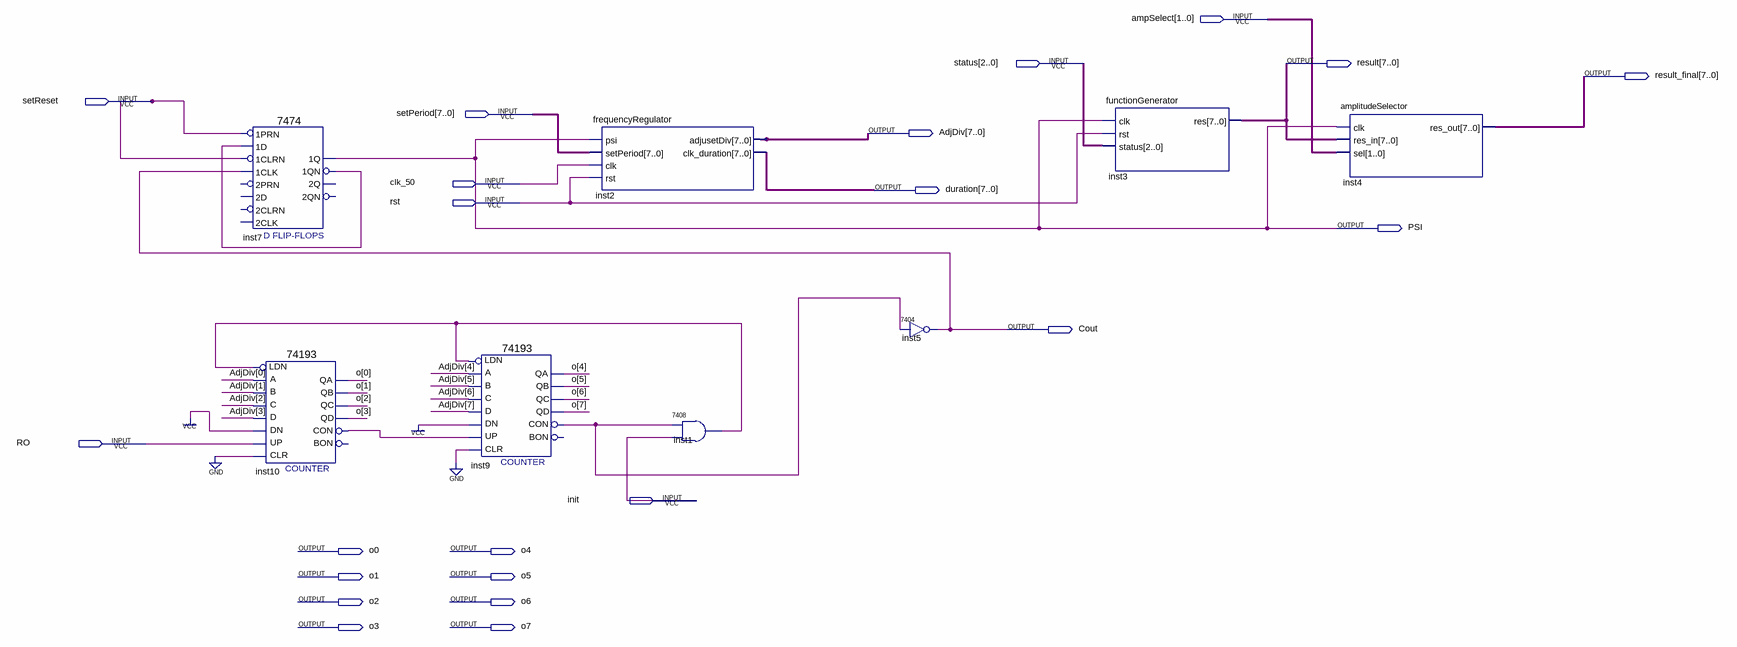
[diagram p0: schematic sheet]
// Quartus schematic FunctionGenerator.bdf as structural Verilog: 8 symbols, 22 pins
module FunctionGenerator (
  input  [1:0] ampSelect,
  input  [2:0] status,
  input  setReset,
  input  [7:0] setPeriod,
  input  clk_50,
  input  rst,
  input  RO,
  input  init,
  output [7:0] result,
  output [7:0] result_final,
  output [7:0] AdjDiv,
  output [7:0] duration,
  output PSI,
  output Cout,
  output o0,
  output o4,
  output o1,
  output o5,
  output o2,
  output o6,
  output o3,
  output o7
);

  wire inst1_1, inst7_1qn, inst9_con, inst10_con;

  \7474  inst7 (
    .\1CLK (Cout), .\1D (inst7_1qn), .\1PRN (setReset), .\1CLRN (setReset), .\1QN (inst7_1qn), .\1Q (PSI));  // open: 2D, 2PRN, 2CLK, 2CLRN, 2Q, 2QN
  \74193  inst10 (
    .D(AdjDiv[3]), .C(AdjDiv[2]), .B(AdjDiv[1]), .A(AdjDiv[0]), .CLR(1'b0), .UP(RO), .DN(1'b1),
    .LDN(inst1_1), .QB(o1), .QA(o0), .CON(inst10_con), .QD(o3), .QC(o2));  // open: BON
  \74193  inst9 (
    .D(AdjDiv[7]), .C(AdjDiv[6]), .B(AdjDiv[5]), .A(AdjDiv[4]), .CLR(1'b0), .UP(inst10_con), .DN(1'b1),
    .LDN(inst1_1), .QB(o5), .QA(o4), .CON(inst9_con), .QD(o7), .QC(o6));  // open: BON
  frequencyRegulator inst2 (
    .psi(PSI), .setPeriod(setPeriod), .clk(clk_50), .rst(rst), .adjusetDiv(AdjDiv), .clk_duration(duration));
  \7408  inst1 (.\3 (init), .\2 (inst9_con), .\1 (inst1_1));
  \7404  inst5 (.\2 (inst9_con), .\1 (Cout));
  functionGenerator inst3 (.clk(PSI), .rst(rst), .status(status), .res(result));
  amplitudeSelector inst4 (.clk(PSI), .res_in(result), .sel(ampSelect), .res_out(result_final));
endmodule
